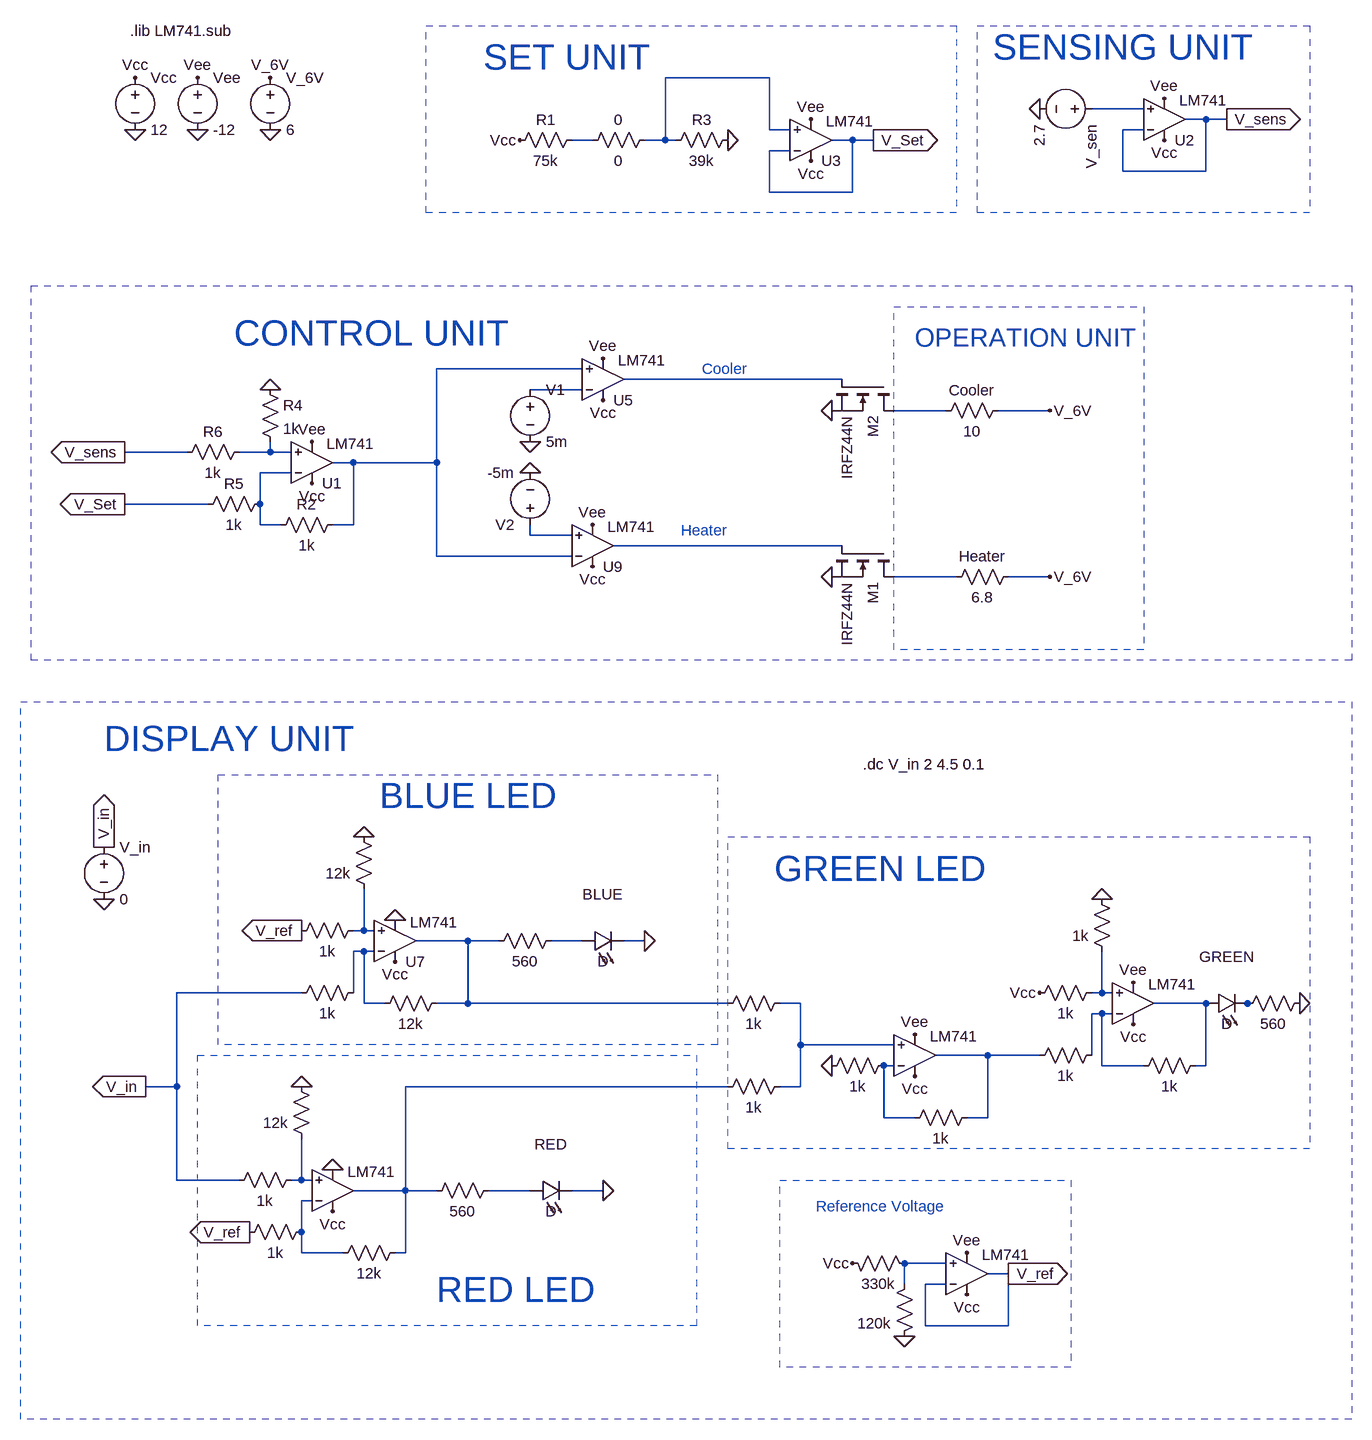
[diagram p0: schematic micro_air_conditioner.asc]
micro_air_conditioner.asc, the LTspice schematic file:
Version 4
SHEET 1 1972 2184
WIRE 544 -480 384 -480
WIRE 1120 -432 1040 -432
WIRE 1216 -416 1184 -416
WIRE 1248 -416 1216 -416
WIRE 544 -400 544 -480
WIRE 576 -400 544 -400
WIRE 1120 -400 1088 -400
WIRE 272 -384 240 -384
WIRE 384 -384 384 -480
WIRE 384 -384 352 -384
WIRE 400 -384 384 -384
WIRE 672 -384 640 -384
WIRE 704 -384 672 -384
WIRE 576 -368 544 -368
WIRE 1088 -336 1088 -400
WIRE 1216 -336 1216 -416
WIRE 1216 -336 1088 -336
WIRE 544 -304 544 -368
WIRE 672 -304 672 -384
WIRE 672 -304 544 -304
WIRE 256 -32 32 -32
WIRE 656 -16 320 -16
WIRE 256 0 176 0
WIRE 816 32 736 32
WIRE 976 32 896 32
WIRE -352 96 -448 96
WIRE -224 96 -224 80
WIRE -224 96 -272 96
WIRE -192 96 -224 96
WIRE -96 112 -128 112
WIRE 32 112 32 -32
WIRE 32 112 -96 112
WIRE -192 128 -240 128
WIRE -320 176 -448 176
WIRE -240 176 -240 128
WIRE -240 208 -240 176
WIRE -208 208 -240 208
WIRE -96 208 -96 112
WIRE -96 208 -128 208
WIRE 176 224 176 208
WIRE 240 224 176 224
WIRE 656 240 304 240
WIRE 32 256 32 112
WIRE 240 256 32 256
WIRE 832 288 736 288
WIRE 976 288 912 288
WIRE -80 832 -80 768
WIRE -80 832 -96 832
WIRE -64 832 -80 832
WIRE 80 848 0 848
WIRE 128 848 80 848
WIRE 256 848 208 848
WIRE 352 848 320 848
WIRE -80 864 -96 864
WIRE -64 864 -80 864
WIRE -176 928 -368 928
WIRE -96 928 -96 864
WIRE 1056 928 1056 864
WIRE 1056 928 1040 928
WIRE 1072 928 1056 928
WIRE -80 944 -80 864
WIRE -48 944 -80 944
WIRE 80 944 80 848
WIRE 80 944 32 944
WIRE 480 944 80 944
WIRE 592 944 560 944
WIRE 1216 944 1136 944
WIRE 1280 944 1264 944
WIRE 1056 960 1040 960
WIRE 1072 960 1056 960
WIRE 592 1008 592 944
WIRE 736 1008 592 1008
WIRE 880 1024 800 1024
WIRE 960 1024 880 1024
WIRE 1040 1024 1040 960
WIRE 736 1040 720 1040
WIRE 1056 1040 1056 960
WIRE 1120 1040 1056 1040
WIRE 1216 1040 1216 944
WIRE 1216 1040 1200 1040
WIRE -368 1072 -368 928
WIRE -368 1072 -416 1072
WIRE 480 1072 -16 1072
WIRE 592 1072 592 1008
WIRE 592 1072 560 1072
WIRE 720 1120 720 1040
WIRE 768 1120 720 1120
WIRE 880 1120 880 1024
WIRE 880 1120 848 1120
WIRE -368 1216 -368 1072
WIRE -272 1216 -368 1216
WIRE -176 1216 -176 1152
WIRE -176 1216 -192 1216
WIRE -160 1216 -176 1216
WIRE -16 1232 -16 1072
WIRE -16 1232 -96 1232
WIRE 32 1232 -16 1232
WIRE 176 1232 112 1232
WIRE 288 1232 240 1232
WIRE -160 1248 -176 1248
WIRE -176 1296 -176 1248
WIRE -176 1328 -176 1296
WIRE -112 1328 -176 1328
WIRE -16 1328 -16 1232
WIRE -16 1328 -32 1328
WIRE 816 1344 752 1344
WIRE 912 1360 880 1360
WIRE 752 1376 752 1344
WIRE 816 1376 784 1376
WIRE 784 1440 784 1376
WIRE 912 1440 912 1360
WIRE 912 1440 784 1440
FLAG 480 -384 0
FLAG -432 -400 0
FLAG -336 -400 0
FLAG -432 -480 Vcc
FLAG -336 -480 Vee
FLAG -160 144 Vcc
FLAG -160 80 Vee
FLAG 1248 -416 V_sens
IOPIN 1248 -416 Out
FLAG 1152 -448 Vee
FLAG 1152 -384 Vcc
FLAG 960 -432 0
FLAG -32 880 Vcc
FLAG -80 688 0
FLAG -128 1264 Vcc
FLAG -176 1072 0
FLAG 288 1232 0
FLAG -224 -400 0
FLAG -224 -480 V_6V
FLAG 976 288 V_6V
FLAG 640 288 0
FLAG 976 32 V_6V
FLAG 640 32 0
FLAG 352 848 0
FLAG -32 816 0
FLAG -128 1200 0
FLAG 640 1040 0
FLAG 768 1056 Vcc
FLAG 1104 976 Vcc
FLAG 1056 784 0
FLAG 960 928 Vcc
FLAG 288 16 Vcc
FLAG 288 -48 Vee
FLAG 176 80 0
FLAG 272 272 Vcc
FLAG 272 208 Vee
FLAG 176 128 0
FLAG 1360 944 0
FLAG 160 -384 Vcc
FLAG -448 176 V_Set
IOPIN -448 176 Out
FLAG -224 0 0
FLAG -448 96 V_sens
IOPIN -448 96 Out
FLAG 608 -416 Vee
FLAG 608 -352 Vcc
FLAG 704 -384 V_Set
IOPIN 704 -384 Out
FLAG -176 832 V_ref
IOPIN -176 832 Out
FLAG -256 1296 V_ref
IOPIN -256 1296 Out
FLAG 848 1328 Vee
FLAG 848 1392 Vcc
FLAG 912 1360 V_ref
IOPIN 912 1360 Out
FLAG 752 1456 0
FLAG 672 1344 Vcc
FLAG -480 784 0
FLAG -480 704 V_in
IOPIN -480 704 Out
FLAG -416 1072 V_in
IOPIN -416 1072 Out
FLAG 768 992 Vee
FLAG 1104 912 Vee
SYMBOL res 256 -400 R90
WINDOW 0 0 56 VBottom 2
WINDOW 3 32 56 VTop 2
SYMATTR InstName R1
SYMATTR Value 75k
SYMBOL res 368 -400 R90
WINDOW 0 0 56 VBottom 2
WINDOW 3 32 56 VTop 2
SYMATTR InstName 0
SYMATTR Value 0
SYMBOL res 496 -400 R90
WINDOW 0 0 56 VBottom 2
WINDOW 3 32 56 VTop 2
SYMATTR InstName R3
SYMATTR Value 39k
SYMBOL voltage -432 -496 R0
WINDOW 123 0 0 Left 0
WINDOW 39 0 0 Left 0
SYMATTR InstName Vcc
SYMATTR Value 12
SYMBOL voltage -336 -496 R0
WINDOW 123 0 0 Left 0
WINDOW 39 0 0 Left 0
SYMATTR InstName Vee
SYMATTR Value -12
SYMBOL OpAmps\\opamp2 -160 176 M180
WINDOW 3 23 93 Left 2
SYMATTR Value LM741
SYMATTR InstName U1
SYMBOL voltage 1056 -432 R90
WINDOW 123 0 0 Left 0
WINDOW 39 0 0 Left 0
SYMATTR InstName V_sen
SYMATTR Value 2.7
SYMBOL OpAmps\\opamp2 1152 -352 M180
WINDOW 3 23 93 Left 2
SYMATTR Value LM741
SYMATTR InstName U2
SYMBOL res 928 272 R90
WINDOW 0 0 56 VBottom 2
WINDOW 3 32 56 VTop 2
SYMATTR InstName Heater
SYMATTR Value 6.8
SYMBOL OpAmps\\opamp2 -32 912 M180
WINDOW 3 23 93 Left 2
SYMATTR Value LM741
SYMATTR InstName U7
SYMBOL res -80 816 R90
WINDOW 0 0 56 Invisible 2
WINDOW 3 32 56 VTop 2
SYMATTR InstName R11
SYMATTR Value 1k
SYMBOL res -80 912 R90
WINDOW 0 0 56 Invisible 2
WINDOW 3 32 56 VTop 2
SYMATTR InstName R12
SYMATTR Value 1k
SYMBOL res 48 928 R90
WINDOW 0 0 56 Invisible 2
WINDOW 3 32 56 VTop 2
SYMATTR InstName R13
SYMATTR Value 12k
SYMBOL res -64 784 R180
WINDOW 0 36 76 Invisible 0
WINDOW 3 36 40 Left 2
SYMATTR InstName R14
SYMATTR Value 12k
SYMBOL LED 256 864 R270
WINDOW 0 72 32 VTop 2
WINDOW 3 0 32 VBottom 2
SYMATTR InstName BLUE
SYMBOL OpAmps\\opamp2 -128 1296 M180
WINDOW 3 23 93 Left 2
WINDOW 0 16 32 Invisible 2
SYMATTR Value LM741
SYMATTR InstName U8
SYMBOL res -176 1200 R90
WINDOW 0 0 56 Invisible 2
WINDOW 3 32 56 VTop 2
SYMATTR InstName 1k
SYMATTR Value 1k
SYMBOL res -160 1280 R90
WINDOW 0 0 56 Invisible 2
WINDOW 3 32 56 VTop 2
SYMATTR InstName R17
SYMATTR Value 1k
SYMBOL res -16 1312 R90
WINDOW 0 0 56 Invisible 2
WINDOW 3 32 56 VTop 2
SYMATTR InstName R18
SYMATTR Value 12k
SYMBOL res -160 1168 R180
WINDOW 0 36 76 Invisible 2
WINDOW 3 36 40 Left 2
SYMATTR InstName R19
SYMATTR Value 12k
SYMBOL LED 176 1248 R270
WINDOW 0 72 32 VTop 2
WINDOW 3 0 32 VBottom 2
SYMATTR InstName RED
SYMBOL res 128 1216 R90
WINDOW 0 0 56 Invisible 0
WINDOW 3 32 56 VTop 2
SYMATTR InstName R20
SYMATTR Value 560
SYMBOL LED 1216 960 R270
WINDOW 0 72 32 VTop 2
WINDOW 3 0 32 VBottom 2
SYMATTR InstName GREEN
SYMBOL res 224 832 R90
WINDOW 0 0 56 Invisible 2
WINDOW 3 32 56 VTop 2
SYMATTR InstName R15
SYMATTR Value 560
SYMBOL voltage -224 -496 R0
WINDOW 123 0 0 Left 0
WINDOW 39 0 0 Left 0
SYMATTR InstName V_6V
SYMATTR Value 6
SYMBOL nmos 736 240 R90
SYMATTR InstName M1
SYMATTR Value IRFZ44N
SYMBOL res 912 16 R90
WINDOW 0 0 56 VBottom 2
WINDOW 3 32 56 VTop 2
SYMATTR InstName Cooler
SYMATTR Value 10
SYMBOL nmos 736 -16 R90
SYMATTR InstName M2
SYMATTR Value IRFZ44N
SYMBOL OpAmps\\opamp2 768 1088 M180
WINDOW 3 23 93 Left 2
WINDOW 0 16 32 Invisible 2
SYMATTR Value LM741
SYMATTR InstName U14
SYMBOL res 736 1024 R90
WINDOW 0 0 56 Invisible 2
WINDOW 3 32 56 VTop 2
SYMATTR InstName R10
SYMATTR Value 1k
SYMBOL res 576 928 R90
WINDOW 0 0 56 Invisible 2
WINDOW 3 32 56 VTop 2
SYMATTR InstName R38
SYMATTR Value 1k
SYMBOL res 464 1088 R270
WINDOW 0 32 56 Invisible 2
WINDOW 3 0 56 VBottom 2
SYMATTR InstName R39
SYMATTR Value 1k
SYMBOL OpAmps\\opamp2 1104 1008 M180
WINDOW 3 23 93 Left 2
WINDOW 0 16 32 Invisible 2
SYMATTR Value LM741
SYMATTR InstName U15
SYMBOL res 1056 912 R90
WINDOW 0 0 56 Invisible 2
WINDOW 3 32 56 VTop 2
SYMATTR InstName R40
SYMATTR Value 1k
SYMBOL res 1056 1008 R90
WINDOW 0 0 56 Invisible 2
WINDOW 3 32 56 VTop 2
SYMATTR InstName R41
SYMATTR Value 1k
SYMBOL res 1216 1024 R90
WINDOW 0 0 56 Invisible 2
WINDOW 3 32 56 VTop 2
SYMATTR InstName R42
SYMATTR Value 1k
SYMBOL res 1072 880 R180
WINDOW 0 36 76 Invisible 2
WINDOW 3 36 40 Left 2
SYMATTR InstName R43
SYMATTR Value 1k
SYMBOL res 1376 928 R90
WINDOW 0 0 56 Invisible 2
WINDOW 3 32 56 VTop 2
SYMATTR InstName R21
SYMATTR Value 560
SYMBOL OpAmps\\opamp2 288 48 M180
WINDOW 3 23 93 Left 2
SYMATTR Value LM741
SYMATTR InstName U5
SYMBOL voltage 176 -16 R0
WINDOW 123 0 0 Left 0
WINDOW 39 0 0 Left 0
SYMATTR InstName V1
SYMATTR Value 5m
SYMBOL OpAmps\\opamp2 272 304 M180
WINDOW 3 23 93 Left 2
SYMATTR Value LM741
SYMATTR InstName U9
SYMBOL voltage 176 224 R180
WINDOW 123 0 0 Left 0
WINDOW 39 0 0 Left 0
SYMATTR InstName V2
SYMATTR Value -5m
SYMBOL res 864 1104 R90
WINDOW 0 0 56 Invisible 2
WINDOW 3 32 56 VTop 2
SYMATTR InstName R7
SYMATTR Value 1k
SYMBOL res -112 192 R90
WINDOW 0 0 56 VBottom 2
WINDOW 3 32 56 VTop 2
SYMATTR InstName R2
SYMATTR Value 1k
SYMBOL res -240 -16 R0
SYMATTR InstName R4
SYMATTR Value 1k
SYMBOL res -224 160 R90
WINDOW 0 0 56 VBottom 2
WINDOW 3 32 56 VTop 2
SYMATTR InstName R5
SYMATTR Value 1k
SYMBOL res -256 80 R90
WINDOW 0 0 56 VBottom 2
WINDOW 3 32 56 VTop 2
SYMATTR InstName R6
SYMATTR Value 1k
SYMBOL OpAmps\\opamp2 608 -320 M180
WINDOW 3 23 93 Left 2
SYMATTR Value LM741
SYMATTR InstName U3
SYMBOL OpAmps\\opamp2 848 1424 M180
WINDOW 3 23 93 Left 2
WINDOW 0 16 32 Invisible 2
SYMATTR Value LM741
SYMATTR InstName U4
SYMBOL res 768 1360 M0
WINDOW 0 36 40 Invisible 2
SYMATTR InstName R8
SYMATTR Value 120k
SYMBOL res 656 1328 M90
WINDOW 0 0 56 Invisible 2
WINDOW 3 32 56 VTop 2
SYMATTR InstName R9
SYMATTR Value 330k
SYMBOL voltage -480 688 R0
WINDOW 123 0 0 Left 0
WINDOW 39 0 0 Left 0
SYMATTR InstName V_in
SYMATTR Value 0
TEXT -440 -552 Left 2 !.lib LM741.sub
TEXT 688 576 Left 2 !.dc V_in 2 4.5 0.1
TEXT 440 -32 Left 2 ;Cooler
TEXT 408 216 Left 2 ;Heater
TEXT -56 624 Left 5 ;BLUE LED
TEXT 32 1384 Left 5 ;RED LED
TEXT 552 736 Left 5 ;GREEN LED
TEXT 616 1256 Left 2 ;Reference Voltage
TEXT 104 -512 Left 5 ;SET UNIT
TEXT -280 -88 Left 5 ;CONTROL UNIT
TEXT -480 536 Left 5 ;DISPLAY UNIT
TEXT 888 -528 Left 5 ;SENSING UNIT
TEXT 768 -80 Left 4 ;OPERATION UNIT
RECTANGLE Normal 464 1008 -304 592 2
RECTANGLE Normal 432 1440 -336 1024 2
RECTANGLE Normal 1376 1168 480 688 2
RECTANGLE Normal 1440 416 -592 -160 2
RECTANGLE Normal 1440 1584 -608 480 2
RECTANGLE Normal 832 -272 16 -560 2
RECTANGLE Normal 1376 -272 864 -560 2
RECTANGLE Normal 1120 400 736 -128 2
RECTANGLE Normal 1008 1504 560 1216 2

The netlist it stands for:
* micro_air_conditioner.asc
R1 N003 Vcc 75k
R§0 N001 N003 0
R3 0 N001 39k
Vcc Vcc 0 12
Vee Vee 0 -12
XU1 N008 N009 Vcc Vee N004 LM741  ; pins In+ In- V+ V- OUT
V_sen N002 0 2.7
XU2 N002 V_sens Vcc Vee V_sens LM741  ; pins In+ In- V+ V- OUT
R§Heater V_6V N012 6.8
XU7 N013 N016 Vcc 0 N014 LM741  ; pins In+ In- V+ V- OUT
R11 N013 V_ref 1k
R12 N016 V_in 1k
R13 N014 N016 12k
R14 N013 0 12k
D§BLUE N015 0 D
XU8 N025 N027 Vcc 0 N024 LM741  ; pins In+ In- V+ V- OUT
R§1k N025 V_in 1k
R17 N027 V_ref 1k
R18 N024 N027 12k
R19 N025 0 12k
D§RED N026 0 D
R20 N026 N024 560
D§GREEN N019 N020 D
R15 N015 N014 560
V_6V V_6V 0 6
M1 N012 N011 0 0 IRFZ44N
R§Cooler V_6V N007 10
M2 N007 N005 0 0 IRFZ44N
XU14 N018 N023 Vcc Vee N022 LM741  ; pins In+ In- V+ V- OUT
R10 N023 0 1k
R38 N018 N014 1k
R39 N024 N018 1k
XU15 N017 N021 Vcc Vee N019 LM741  ; pins In+ In- V+ V- OUT
R40 N017 Vcc 1k
R41 N021 N022 1k
R42 N019 N021 1k
R43 N017 0 1k
R21 0 N020 560
XU5 N004 N006 Vcc Vee N005 LM741  ; pins In+ In- V+ V- OUT
V1 N006 0 5m
XU9 N010 N004 Vcc Vee N011 LM741  ; pins In+ In- V+ V- OUT
V2 N010 0 -5m
R7 N022 N023 1k
R2 N004 N009 1k
R4 0 N008 1k
R5 N009 V_Set 1k
R6 N008 V_sens 1k
XU3 N001 V_Set Vcc Vee V_Set LM741  ; pins In+ In- V+ V- OUT
XU4 N028 V_ref Vcc Vee V_ref LM741  ; pins In+ In- V+ V- OUT
R8 N028 0 120k
R9 Vcc N028 330k
V_in V_in 0 0
.model D D
.lib standard.dio
.model NMOS NMOS
.model PMOS PMOS
.lib standard.mos
.lib LM741.sub
.dc V_in 2 4.5 0.1
* Cooler
* Heater
* BLUE LED
* RED LED
* GREEN LED
* Reference Voltage
* SET UNIT
* CONTROL UNIT
* DISPLAY UNIT
* SENSING UNIT
* OPERATION UNIT
.backanno
.end